# EAGLE schematic Desoldering_Station (EAGLE 6.5.0)
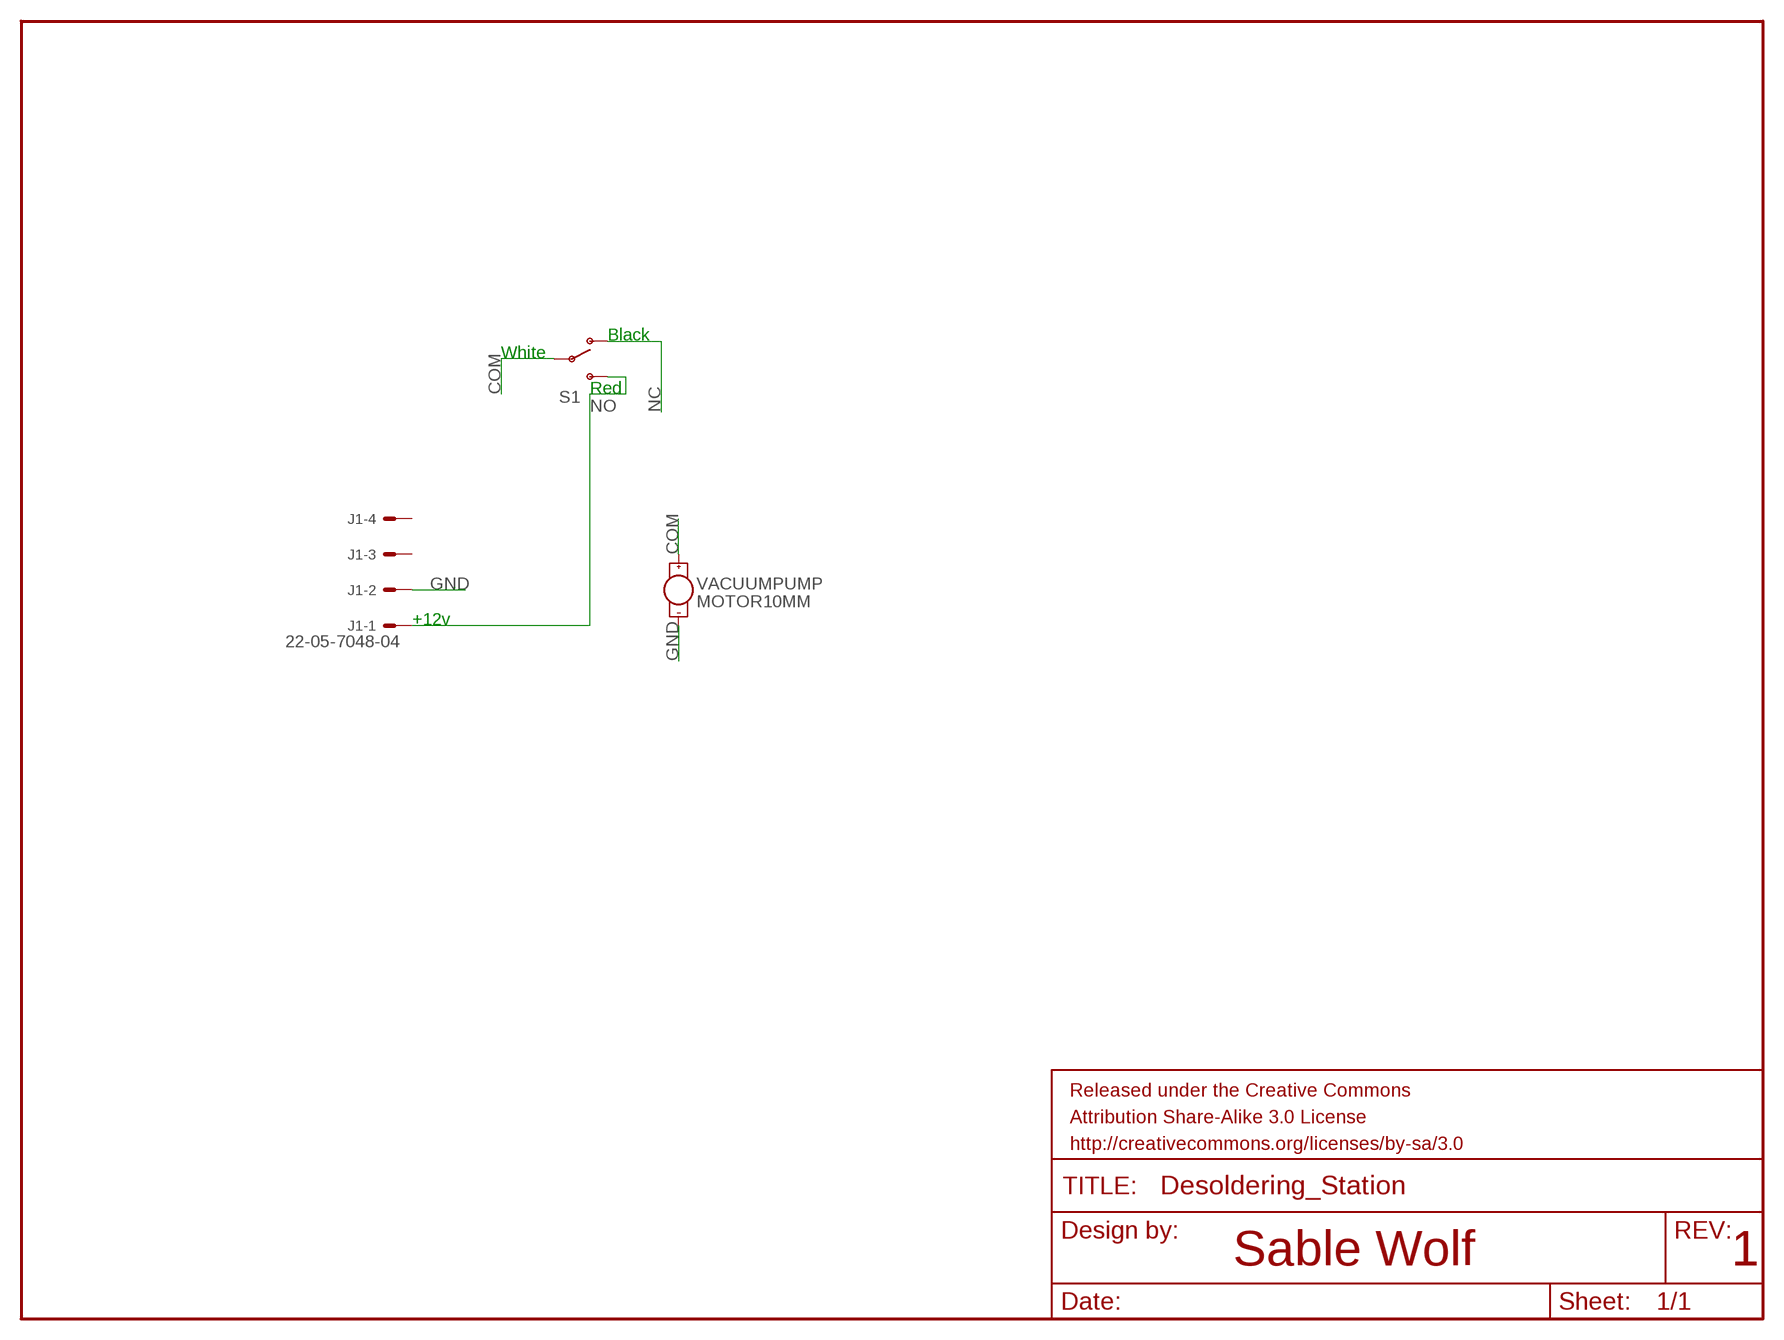
[diagram p0: schematic, sheet 1]

## Parts
FRAME1  FRAME-LETTER  [CREATIVE_COMMONS]
J1  22-05-7048-04  [7395-04]
S1  SWITCH-SPDTKIT  [SWITCH-SPDT_KIT]
VACUUMPUMP  MOTOR10MM  [VIBE-MOTOR-10MM]

## Nets
COM: S1.2(P) VACUUMPUMP.+
GND: J1.2 VACUUMPUMP.-
NC: S1.1(O)
NO: J1.1 S1.3(S)
Unconnected: J1.3 J1.4

## Notes on the sheet
- Black
- White
- Red
- +12v
- Sable Wolf | 1

## Library data of the parts
FRAME1 = SparkFun-Aesthetics:FRAME-LETTER: Schematic Frame Standard 8.5x11 US Letter frame
J1 = con-molex:22-?-04: CONNECTOR wire to board 2.54 mm (.1 inch) pitch header; OC_FARNELL: unknown; OC_NEWARK: unknown
S1 = SparkFun-Electromechanical:SWITCH-SPDT: SPDT Switch Simple slide switch, Spark Fun Electronics SKU : COM-00102 DPDT SMT slide switch, AYZ0202, SWCH-08179; PROD_ID: SWCH-08261
VACUUMPUMP = SparkFun-Electromechanical:MOTOR: Vibration Motor- ROB-08449 Physical dimension and wire connections for this powerful vibration motor. Motor has a self adhesive backing.